# EAGLE design MCPGrundplatte16xOutput (EAGLE 9.6.2)
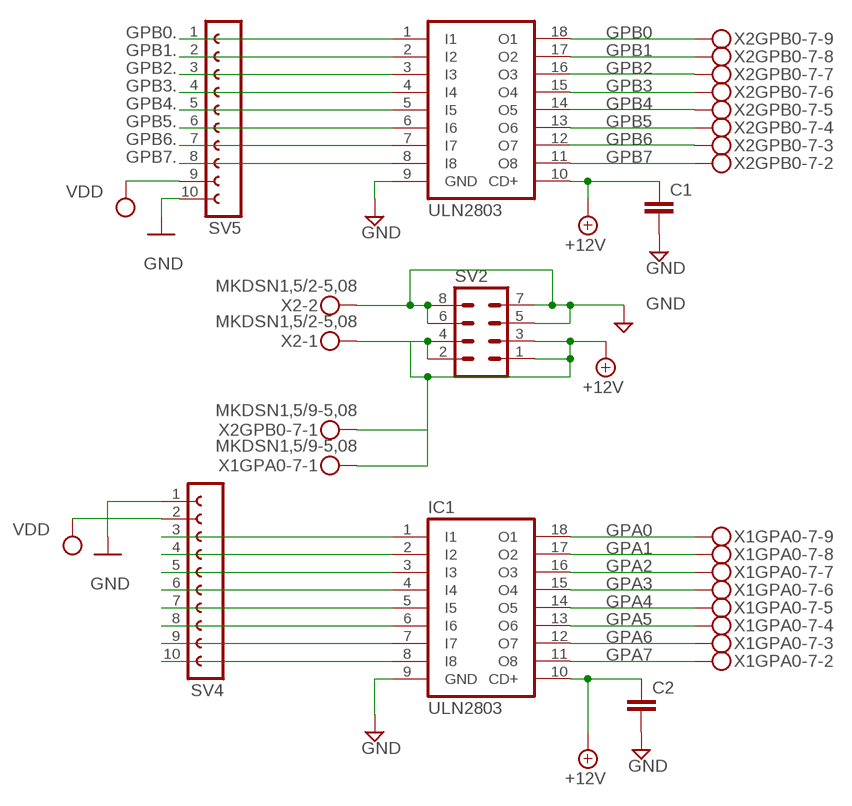
[diagram p0: schematic, sheet 1]

## Parts
C1  C-EU025-024X044  [C025-024X044]
C2  C-EU025-024X044  [C025-024X044]
IC1  ULN2803  ULN2803A  [DIL18]
IC4  ULN2803  ULN2803A  [DIL18]
SV2  MA04-2  [MA04-2]
SV4  FE10-1  [FE10]
SV5  FE10-1  [FE10]
X1GPA0-7  MKDSN1,5/9-5,08  [MKDSN1,5/9-5,08]
X2  MKDSN1,5/2-5,08  [MKDSN1,5/2-5,08]
X2GPB0-7  MKDSN1,5/9-5,08  [MKDSN1,5/9-5,08]

## Nets
+12V: C1.1 C2.1 IC1.10(CD+) IC4.10(CD+) SV2.1 SV2.2 SV2.3 SV2.4 X1GPA0-7.1 X2.1 X2GPB0-7.1
GND: C1.2 C2.2 IC1.9(GND) IC4.9(GND) SV2.5 SV2.6 SV2.7 SV2.8 SV4.1 SV5.10 X2.2
GPA0: IC1.18(O1) X1GPA0-7.9
GPA1: IC1.17(O2) X1GPA0-7.8
GPA2: IC1.16(O3) X1GPA0-7.7
GPA3: IC1.15(O4) X1GPA0-7.6
GPA4: IC1.14(O5) X1GPA0-7.5
GPA5: IC1.13(O6) X1GPA0-7.4
GPA6: IC1.12(O7) X1GPA0-7.3
GPA7: IC1.11(O8) X1GPA0-7.2
GPB0: IC4.18(O1) X2GPB0-7.9
GPB0.: IC4.1(I1) SV5.1
GPB1: IC4.17(O2) X2GPB0-7.8
GPB1.: IC4.2(I2) SV5.2
GPB2: IC4.16(O3) X2GPB0-7.7
GPB2.: IC4.3(I3) SV5.3
GPB3: IC4.15(O4) X2GPB0-7.6
GPB3.: IC4.4(I4) SV5.4
GPB4: IC4.14(O5) X2GPB0-7.5
GPB4.: IC4.5(I5) SV5.5
GPB5: IC4.13(O6) X2GPB0-7.4
GPB5.: IC4.6(I6) SV5.6
GPB6: IC4.12(O7) X2GPB0-7.3
GPB6.: IC4.7(I7) SV5.7
GPB7: IC4.11(O8) X2GPB0-7.2
GPB7.: IC4.8(I8) SV5.8
N$1: IC1.6(I6) SV4.8
N$2: IC1.1(I1) SV4.3
N$3: IC1.2(I2) SV4.4
N$4: IC1.3(I3) SV4.5
N$5: IC1.4(I4) SV4.6
N$6: IC1.5(I5) SV4.7
N$7: IC1.7(I7) SV4.9
N$8: IC1.8(I8) SV4.10
VDD: SV4.2 SV5.9

## Library data of the parts
C1 C2 = rcl:C-EU: CAPACITOR, European symbol; SPICEPREFIX: C
IC1 IC4 = uln-udn:ULN2803A: DRIVER ARRAY
SV2 = con-lstb:MA04-2: PIN HEADER; OC_FARNELL: unknown; OC_NEWARK: unknown
SV4 SV5 = con-lsta:FE10-1: FEMALE HEADER; OC_FARNELL: unknown; OC_NEWARK: unknown
X1GPA0-7 X2GPB0-7 = con-phoenix-508:MKDSN1,5/9-5,08: MKDSN 1,5/ 9-5,08 Printklemme Nennstrom: 13,5 A Nennspannung: 250 V Rastermaß: 5,08 mm Polzahl: 9 Anschlussart: Schraubanschluss Montage: Löten Anschlussrichtung Leiter/Platine: 0 ° Artikelnummer: 1729199 Source: http://eshop.phoenixcontact.com .. 1729199.pdf
X2 = con-phoenix-508:MKDSN1,5/2-5,08: MKDSN 1,5/ 2-5,08 Printklemme Nennstrom: 13,5 A Nennspannung: 250 V Rastermaß: 5,08 mm Polzahl: 2 Anschlussart: Schraubanschluss Montage: Löten Anschlussrichtung Leiter/Platine: 0 ° Artikelnummer: 1729128 Source: http://eshop.phoenixcontact.com .. 1729128.pdf

## Board
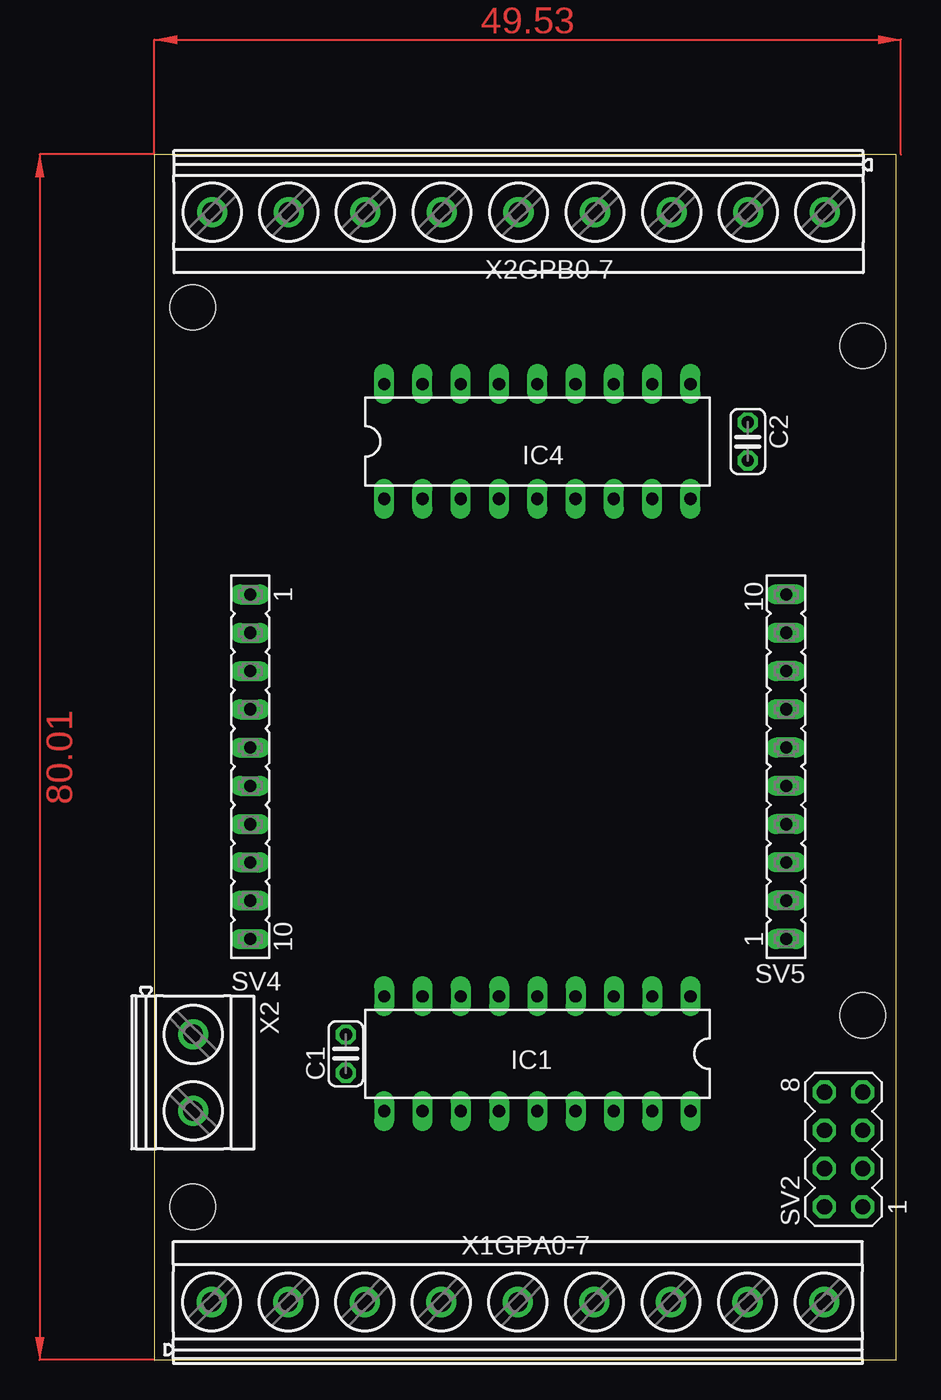
[diagram p1: board, top side]
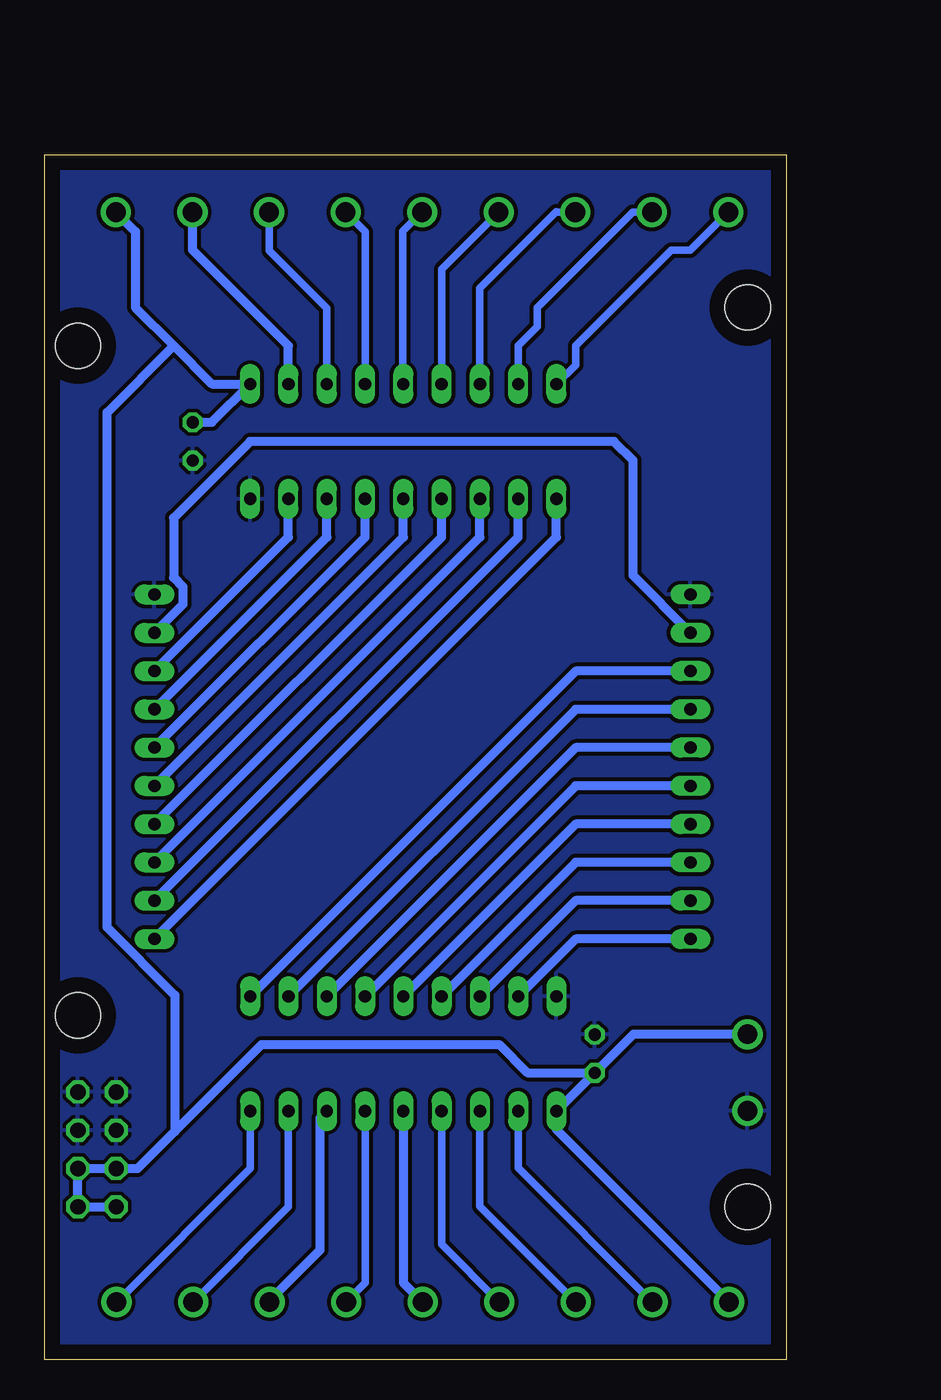
[diagram p2: board, bottom side, seen from below]

Size 49.2 x 80 mm. Coordinates in mm from the lower left corner, seen from the top.
Outline: 0,0 49.2,0 49.2,80 0,80 0,0
Copper layers (1*16): Top 0.035mm / dielectric 1.5mm / Bottom 0.035mm
Design rules "platinenbelichter": minimum track width 10mil, minimum drill 24mil, track to track 10mil, track to pad 10mil, pad to pad 10mil, via to via 10mil, smd to smd 10mil, copper to edge 40mil, drill to drill 8mil, minimum pad ring 10mil, minimum via ring 8mil, stop-mask expansion 10mil, vias tented up to drill 0mil, thermal gap 10mil
Holes 3 mm at 2.54,69.85 46.99,22.86 2.54,10.16 46.99,67.31

### Footprints (pad centres in the part's own frame; a part is rotated, then mirrored left to right if it is on the bottom)
C025-024X044 = drill 0.813 octagon: 1 -1.27,0; 2 1.27,0
DIL18 = drill 0.813 long: 1 -10.16,-3.81; 2 -7.62,-3.81; 3 -5.08,-3.81; 4 -2.54,-3.81; 5 0,-3.81; 6 2.54,-3.81; 7 5.08,-3.81; 8 7.62,-3.81; 9 10.16,-3.81; 10 10.16,3.81; 11 7.62,3.81; 12 5.08,3.81; 13 2.54,3.81; 14 0,3.81; 15 -2.54,3.81; 16 -5.08,3.81; 17 -7.62,3.81; 18 -10.16,3.81
MA04-2 = drill 1.016 octagon: 1 -3.81,-1.27; 2 -3.81,1.27; 3 -1.27,-1.27; 4 -1.27,1.27; 5 1.27,-1.27; 6 1.27,1.27; 7 3.81,-1.27; 8 3.81,1.27
FE10 = drill 0.813 long: 1 -11.43,0; 2 -8.89,0; 3 -6.35,0; 4 -3.81,0; 5 -1.27,0; 6 1.27,0; 7 3.81,0; 8 6.35,0; 9 8.89,0; 10 11.43,0
MKDSN1,5/9-5,08 = drill 1.3 pad 2: 1 -20.341,0.025; 2 -15.261,0.025; 3 -10.181,0.025; 4 -5.101,0.025; 5 -0.021,0.025; 6 5.059,0.025; 7 10.139,0.025; 8 15.219,0.025; 9 20.299,0.025
MKDSN1,5/2-5,08 = drill 1.3 pad 2: 1 -2.561,0.025; 2 2.519,0.025

### Placement (x,y rotation side)
C1  12.7,20.32 90 top
C2  39.37,60.96 270 top
IC1  25.4,20.32 180 top
IC4  25.4,60.96 0 top
SV2  45.72,13.97 90 top
SV4  6.35,39.37 270 top
SV5  41.91,39.37 90 top
X1GPA0-7  24.13,3.81 0 top
X2  2.54,19.05 270 top
X2GPB0-7  24.13,76.2 180 top

### Tracks (layer width: path | path; a pad name or v marks a point on that pad's centre or on a via)
+12V
  Bottom 0.61: X1GPA0-7.1 15.24,15.29 IC1.10 C1.1 | X2.1 10.14,21.61 10.82,20.93 C1.1 | 40.56,15.16 43.02,12.7 SV2.4 SV2.3 SV2.1 SV2.2 | 40.56,15.16 34.8,20.93 19.05,20.93 17.17,19.05 C1.1 | 40.56,15.16 40.56,24.21 45.06,28.7 45.06,62.89 40.64,67.31 | X2GPB0-7.1 43.18,74.88 43.18,69.85 40.64,67.31 | 40.64,67.31 38.1,64.77 IC4.10 38.1,62.23 C2.1
GND
  pour Bottom: 0,80.01 49.53,80.01 49.53,0 0,0
GPA0
  Bottom 0.508: X1GPA0-7.9 35.56,12.7 IC1.18
GPA1
  Bottom 0.508: X1GPA0-7.8 33.02,10.16 IC1.17
GPA2
  Bottom 0.61: IC1.16 30.94,16.05 30.94,7.29 34.27,3.96 X1GPA0-7.7
GPA3
  Bottom 0.508: X1GPA0-7.6 27.92,5.11 27.92,16.49 IC1.15
GPA4
  Bottom 0.61: IC1.14 25.4,5.13 X1GPA0-7.5
GPA5
  Bottom 0.508: X1GPA0-7.4 22.86,7.67 IC1.13
GPA6
  Bottom 0.508: X1GPA0-7.3 20.32,10.21 IC1.12
GPA7
  Bottom 0.508: X1GPA0-7.2 17.78,12.75 IC1.11
GPB0
  Bottom 0.508: X2GPB0-7.9 6.35,73.66 7.62,73.66 13.97,67.31 13.97,66.04 IC4.18
GPB0.
  Bottom 0.61: SV5.1 15.24,54.61 IC4.1
GPB1
  Bottom 0.508: X2GPB0-7.8 10.19,76.17 16.51,69.85 16.51,68.58 17.78,67.31 IC4.17
GPB1.
  Bottom 0.61: SV5.2 17.78,54.61 IC4.2
GPB2
  Bottom 0.508: X2GPB0-7.7 15.21,76.17 15.24,76.2 20.32,71.12 IC4.16
GPB2.
  Bottom 0.61: SV5.3 20.32,54.61 IC4.3
GPB3
  Bottom 0.508: X2GPB0-7.6 22.86,72.39 IC4.15
GPB3.
  Bottom 0.61: SV5.4 22.86,54.61 IC4.4
GPB4
  Bottom 0.508: IC4.14 25.42,64.79 25.42,74.91 X2GPB0-7.5
GPB4.
  Bottom 0.61: SV5.5 25.4,54.61 IC4.5
GPB5
  Bottom 0.508: IC4.13 27.94,74.88 X2GPB0-7.4
GPB5.
  Bottom 0.61: SV5.6 27.94,54.61 IC4.6
GPB6
  Bottom 0.508: IC4.12 30.48,69.8 34.31,73.64 X2GPB0-7.3
GPB6.
  Bottom 0.61: SV5.7 30.48,54.61 IC4.7
GPB7
  Bottom 0.61: X2GPB0-7.2 39.39,73.68 33.02,67.31 IC4.11
GPB7.
  Bottom 0.61: SV5.8 33.02,54.61 IC4.8
N$1
  Bottom 0.61: SV4.8 13.97,33.02 IC1.6
N$2
  Bottom 0.61: SV4.3 13.97,45.72 IC1.1
N$3
  Bottom 0.61: SV4.4 13.97,43.18 IC1.2
N$4
  Bottom 0.61: SV4.5 13.97,40.64 IC1.3
N$5
  Bottom 0.61: SV4.6 13.97,38.1 IC1.4
N$6
  Bottom 0.61: SV4.7 13.97,35.56 IC1.5
N$7
  Bottom 0.61: SV4.9 13.97,30.48 IC1.7
N$8
  Bottom 0.61: SV4.10 13.97,27.94 IC1.8
VDD
  Bottom 0.61: SV4.2 10.16,52.07 10.16,59.69 11.43,60.96 35.56,60.96 40.64,55.88 40.64,51.91 40.03,51.3 40.03,50.14 SV5.9
(copper drawn outside any net)
  shapes: Top area x2

### Text on the board
tDocu: SX2MCP23017 / 16 x OUTPUT / Version V1